# EAGLE design io (EAGLE 7.7.0)
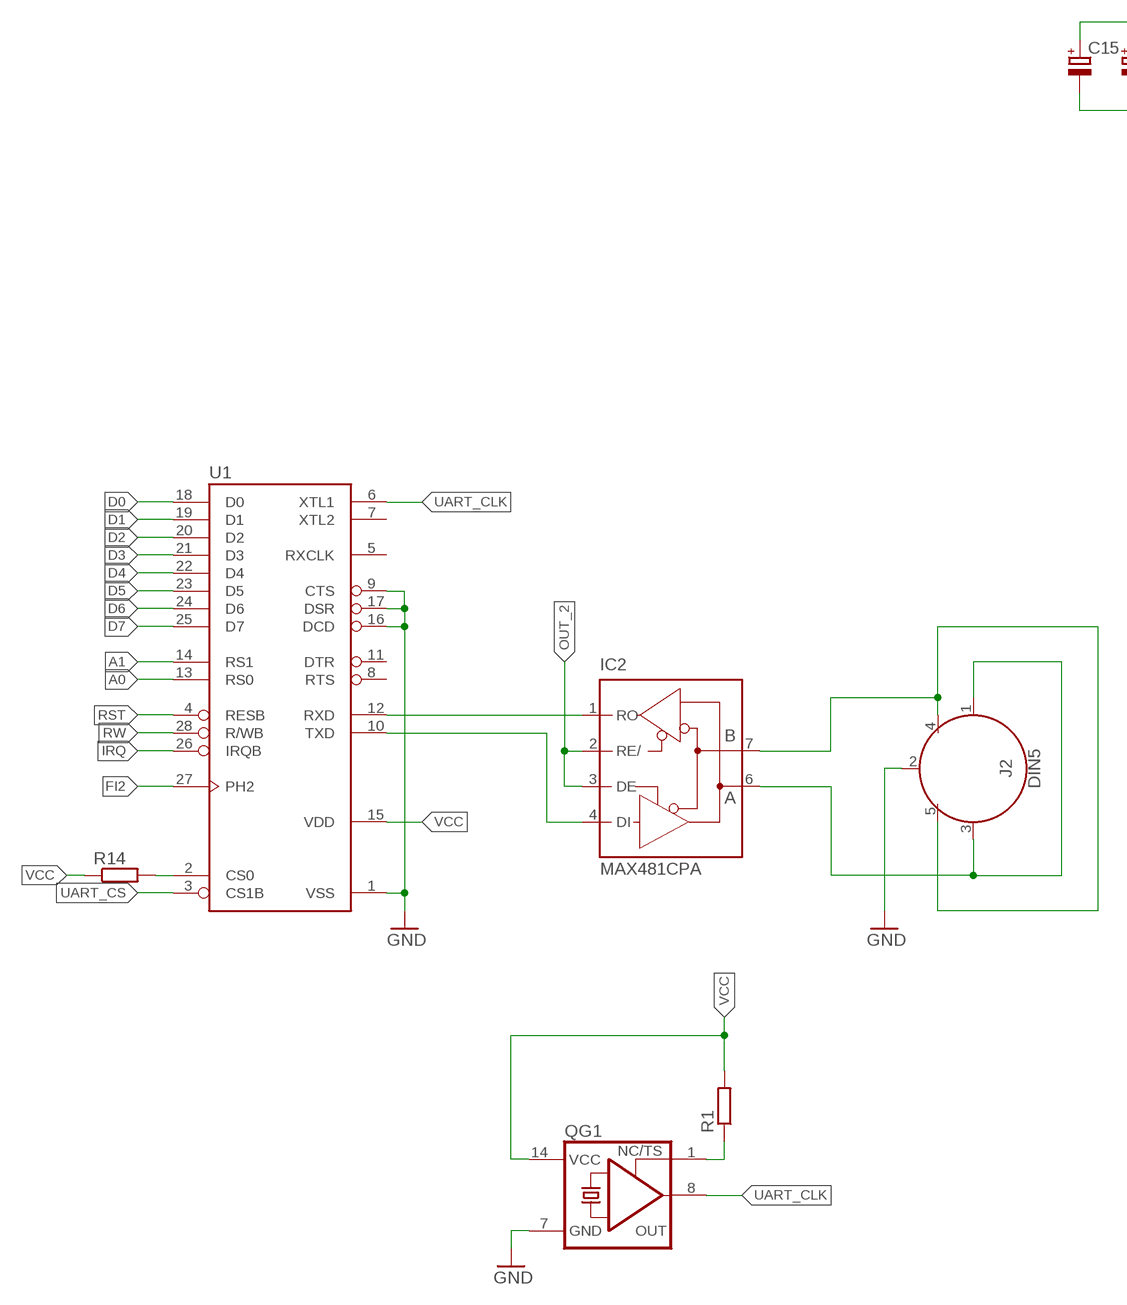
[diagram p0: schematic, sheet 1, part 1 of 2]
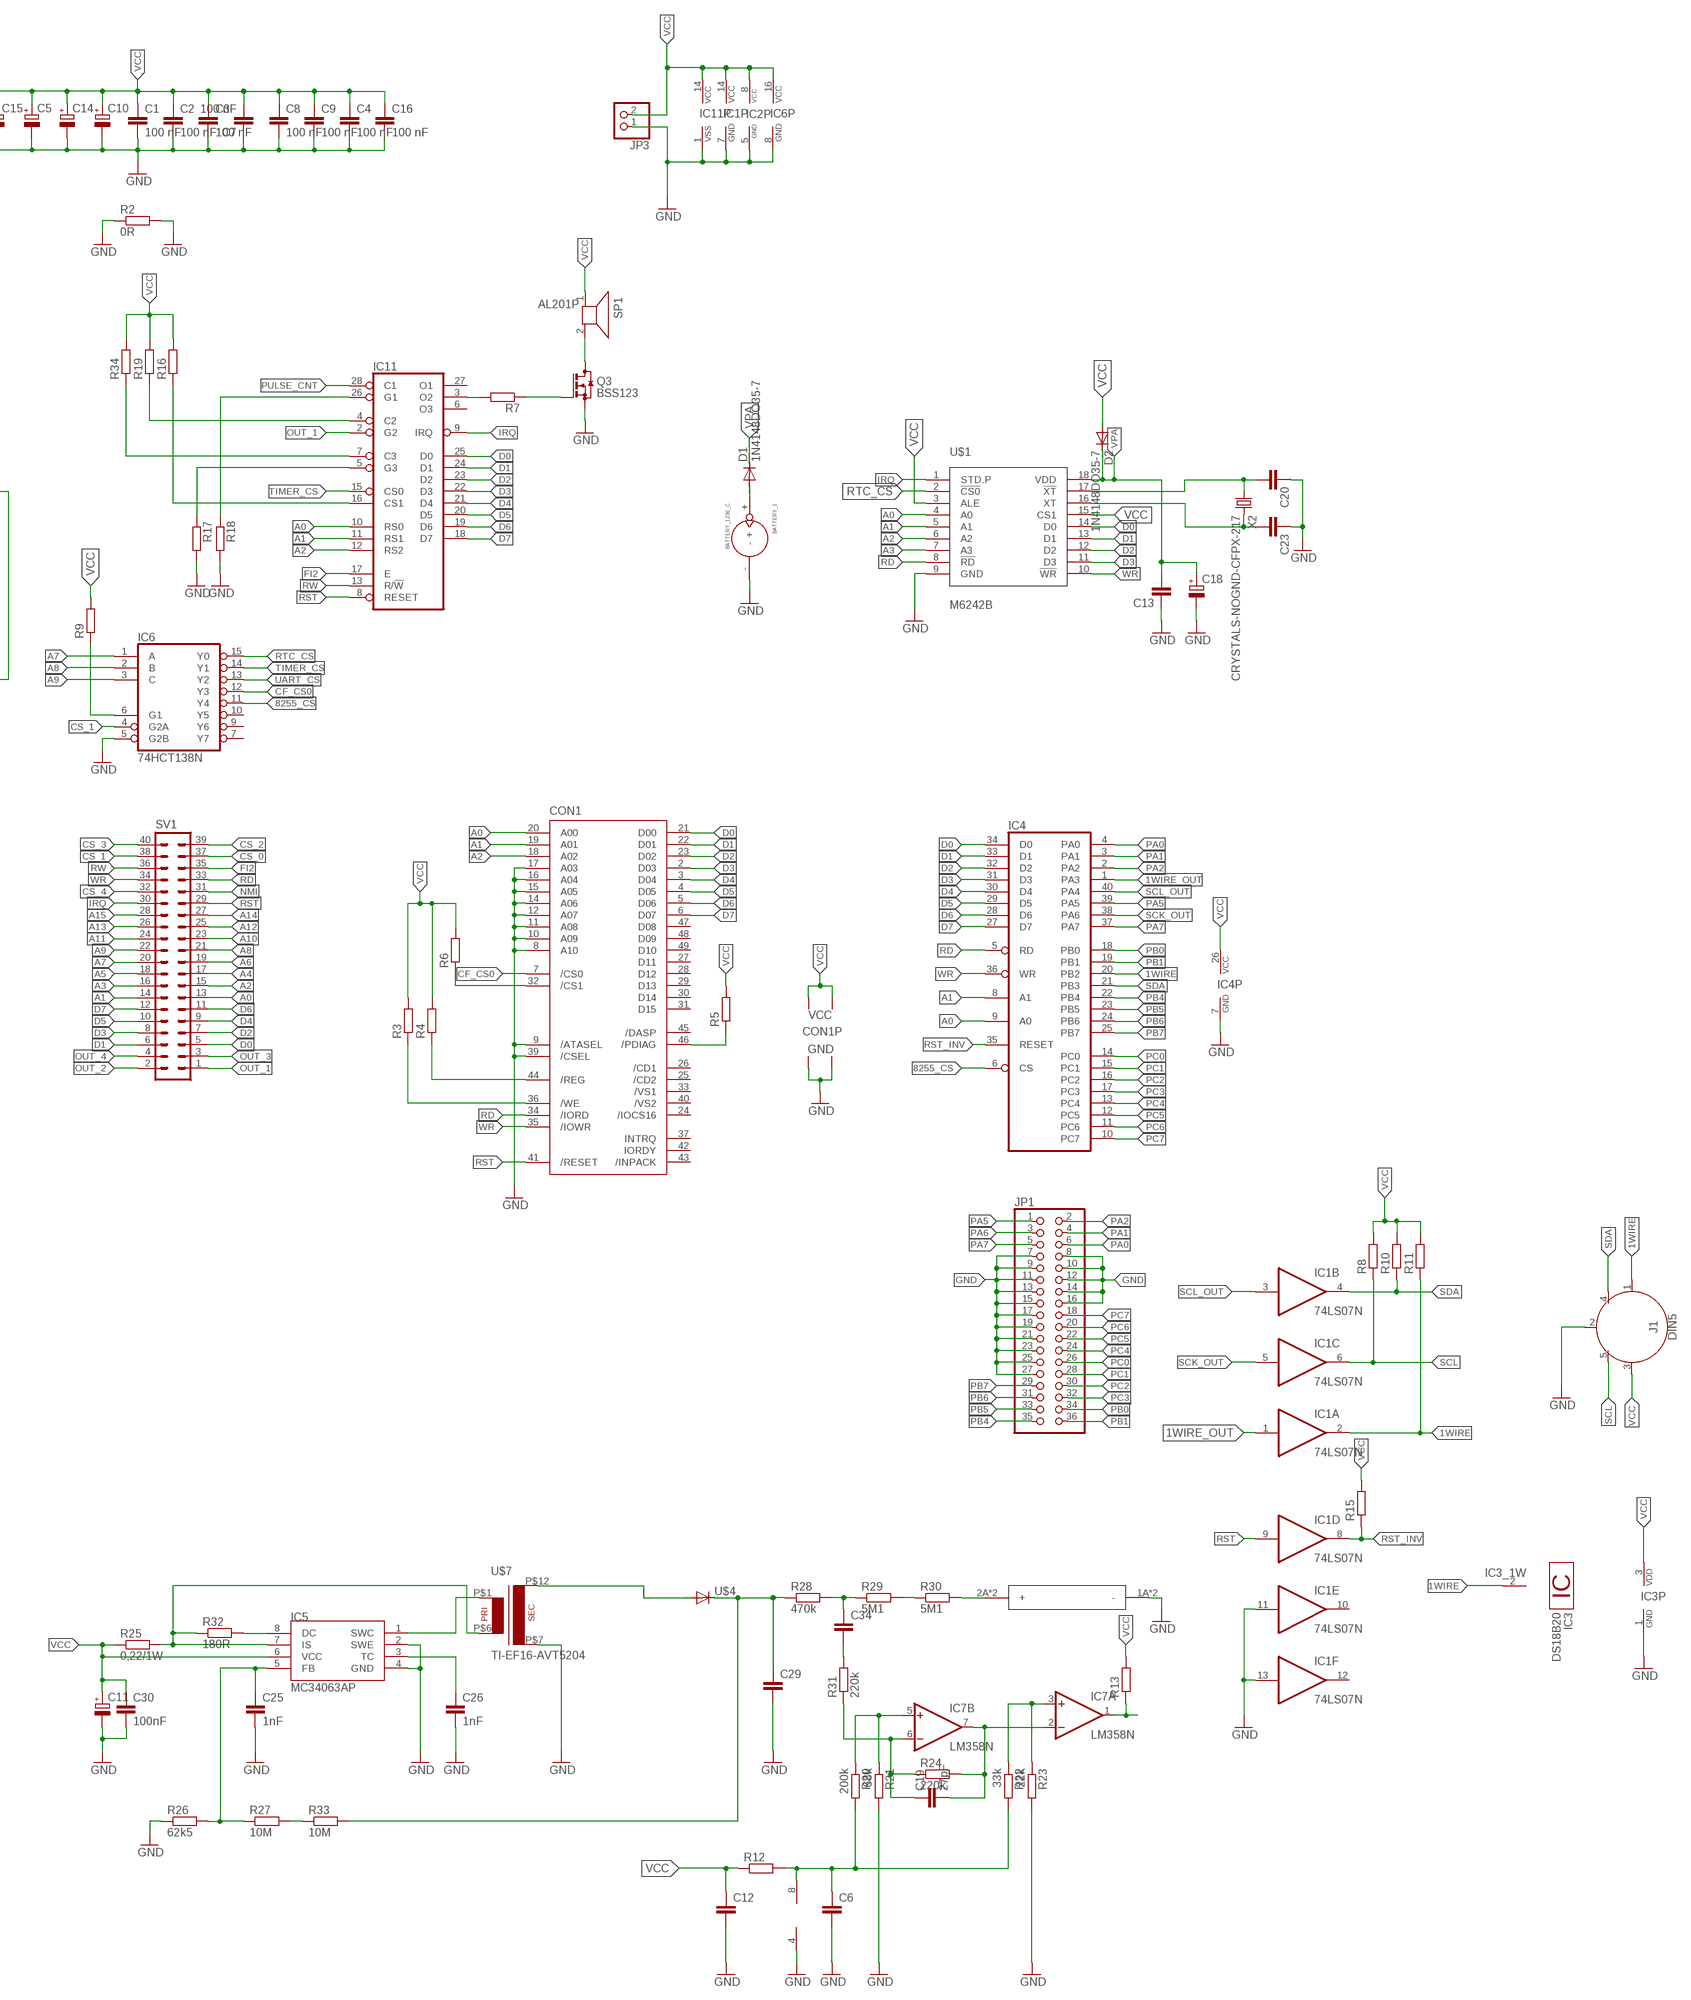
[diagram p1: schematic, sheet 1, part 2 of 2]

## Parts
BATTERY_1  BATTERY_1236_C  [BATTERY_1236_C]
C1  100 nF  C-EUC1206  [C1206]
C2  100 nF  C-EUC1206  [C1206]
C3  100 nF  C-EUC1206  [C1206]
C4  100 nF  C-EUC0603  [C0603]
C5  CPOL-EUSMCC  [SMC_C]
C6  C-EUC0603  [C0603]
C7  100 nF  C-EUC0603  [C0603]
C8  100 nF  C-EUC1206  [C1206]
C9  100 nF  C-EUC1206  [C1206]
C10  CPOL-EUE5-10.5  [E5-10,5]
C11  CPOL-EUSMCE  [SMC_E]
C12  C-EUC0603  [C0603]
C13  C-EUC0603  [C0603]
C14  CPOL-EUE3.5-8  [E3,5-8]
C15  CPOL-EUE5-10.5  [E5-10,5]
C16  100 nF  C-EUC0603  [C0603]
C18  CPOL-EUSMCB  [SMC_B]
C19  27pF  C-EUC0603  [C0603]
C20  C-EUC0603  [C0603]
C23  C-EUC0603  [C0603]
C25  1nF  C-EUC0603  [C0603]
C26  1nF  C-EUC0603  [C0603]
C29  C-EU225-113X268  [C225-113X268]
C30  100nF  C-EUC0603  [C0603]
C34  C-EU050-024X044  [C050-024X044]
CON1  CF-CARD-IDE_MODE  [MI20-50PD-SF]
D1  1N4148DO35-7  [DO35-7]
D2  1N4148DO35-7  [DO35-7]
IC1  74LS07N  [DIL14]
IC2  MAX481CPA  [DIL08]
IC3  DS18B20  [TO92-]
IC4  8255A  [DIL40]
IC5  MC34063AP  [DIL08]
IC6  74HCT138N  [DIL16]
IC7  LM358N  [DIL08]
IC11  6840  [DIL28]
J1  DIN5  [DIN5-RA-PTH]
J2  DIN5  [DIN5-RA-PTH]
JP1  PINHD-2X18  [2X18]
JP3  PINHD-1X2/90  [1X02/90]
Q3  BSS123  [SOT23]
QG1  XO-14  [DIL14S]
R1  R-EU_R1206  [R1206]
R2  0R  R-EU_M1206  [M1206]
R3  R-EU_R0603  [R0603]
R4  R-EU_R0603  [R0603]
R5  R-EU_R0603  [R0603]
R6  R-EU_R0603  [R0603]
R7  R-EU_0204/5  [0204/5]
R8  R-EU_0204/7  [0204/7]
R9  R-EU_R1206  [R1206]
R10  R-EU_0204/7  [0204/7]
R11  R-EU_0204/7  [0204/7]
R12  R-EU_0204/7  [0204/7]
R13  R-EU_R0603  [R0603]
R14  R-EU_R0603  [R0603]
R15  R-EU_R0603  [R0603]
R16  R-EU_R0402  [R0402]
R17  R-EU_0204/7  [0204/7]
R18  R-EU_R0603  [R0603]
R19  R-EU_0204/5  [0204/5]
R20  200k  R-EU_R0603  [R0603]
R21  68k  R-EU_R0603  [R0603]
R22  33k  R-EU_R0603  [R0603]
R23  22k  R-EU_R0603  [R0603]
R24  220k  R-EU_R0603  [R0603]
R25  0,22/1W  R-EU_R2010  [R2010]
R26  62k5  R-EU_R1206  [R1206]
R27  10M  R-EU_0204/7  [0204/7]
R28  470k  R-EU_R2512  [R2512]
R29  5M1  R-EU_R2512  [R2512]
R30  5M1  R-EU_R2512  [R2512]
R31  220k  R-EU_0204/7  [0204/7]
R32  180R  R-EU_R0805  [R0805]
R33  10M  R-EU_0204/7  [0204/7]
R34  R-EU_R0603  [R0603]
SP1  AL201P  [AL201P]
SV1  ML40L  [ML40L]
U1  G65SC51P  [DIP-28]
U$1  M6242B  [DIL18]
U$4  DIODE-MELF-MLL41  [MELF-MLL41]
U$5  STS5  [GEIGERTUBE]
U$7  TI-EF16-AVT5204  [EF16-K-H-12P-12,5]
X2  CRYSTALS-NOGND-CFPX-217  [3.2X1.5-2-PAD]

## Nets
1WIRE: IC1.2(A:O) IC3.2 IC4.20(PB2) J1.1 R11.1
1WIRE_OUT: IC1.1(A:I) IC4.1(PA3)
8255_CS: IC4.6(CS) IC6.11(Y4)
A0: CON1.20(A00) IC4.9(A0) IC11.10(RS0) SV1.13 U1.13(RS0) U$1.4(A0)
A1: CON1.19(A01) IC4.8(A1) IC11.11(RS1) SV1.14 U1.14(RS1) U$1.5(A1)
A2: CON1.18(A02) IC11.12(RS2) SV1.15 U$1.6(A2)
A3: SV1.16 U$1.7(A3)
A4: SV1.17
A5: SV1.18
A6: SV1.19
A7: IC6.1(A) SV1.20
A8: IC6.2(B) SV1.21
A9: IC6.3(C) SV1.22
A10: SV1.23
A11: SV1.24
A12: SV1.25
A13: SV1.26
A14: SV1.27
A15: SV1.28
A_3V: C6.1 IC7.8(P:V+) R12.2 R20.2 R22.2
CF_CS0: CON1.7(/CS0) IC6.12(Y3)
CS_0: SV1.37
CS_1: IC6.4(G2A) SV1.38
CS_2: SV1.39
CS_3: SV1.40
CS_4: SV1.32
D0: CON1.21(D00) IC4.34(D0) IC11.25(D0) SV1.5 U1.18(D0) U$1.14(D0)
D1: CON1.22(D01) IC4.33(D1) IC11.24(D1) SV1.6 U1.19(D1) U$1.13(D1)
D2: CON1.23(D02) IC4.32(D2) IC11.23(D2) SV1.7 U1.20(D2) U$1.12(D2)
D3: CON1.2(D03) IC4.31(D3) IC11.22(D3) SV1.8 U1.21(D3) U$1.11(D3)
D4: CON1.3(D04) IC4.30(D4) IC11.21(D4) SV1.9 U1.22(D4)
D5: CON1.4(D05) IC4.29(D5) IC11.20(D5) SV1.10 U1.23(D5)
D6: CON1.5(D06) IC4.28(D6) IC11.19(D6) SV1.11 U1.24(D6)
D7: CON1.6(D07) IC4.27(D7) IC11.18(D7) SV1.12 U1.25(D7)
FI2: IC11.17(E) SV1.35 U1.27(PH2)
GND: BATTERY_1.- C1.2 C2.2 C3.2 C4.2 C5.- C6.2 C7.1 C8.2 C9.2 C10.- C11.- C12.2 C13.1 C14.- C15.- C16.2 C18.- C20.1 C23.1 C25.2 C26.2 C29.2 C30.2 CON1.1(GND1) CON1.8(A10) CON1.9(/ATASEL) CON1.10(A09) CON1.11(A08) CON1.12(A07) CON1.14(A06) CON1.15(A05) CON1.16(A04) CON1.17(A03) CON1.39(/CSEL) CON1.50(GND2) IC1.7(P:GND) IC1.11(E:I) IC1.13(F:I) IC2.5(GND) IC3.1 IC4.7(GND) IC5.2(SWE) IC5.4(GND) IC6.5(G2B) IC6.8(GND) IC7.4(P:V-) IC11.1(VSS) J1.2 J2.2 JP1.7 JP1.8 JP1.9 JP1.10 JP1.11 JP1.12 JP1.13 JP1.14 JP1.15 JP1.16 JP1.17 JP1.19 JP1.21 JP1.23 JP1.25 JP1.27 JP3.1 Q3.2(S) QG1.7(GND) R2.1 R2.2 R17.2 R18.2 R21.2 R23.2 R26.1 U1.1(VSS) U1.9(CTS) U1.16(DCD) U1.17(DSR) U$1.9(GND) U$5.1A(-) U$5.1B(-) U$7.P$7(P7)
HV: C29.1 R28.1 R33.2 U$4.C
IRQ: IC11.9(IRQ) SV1.30 U1.26(IRQB) U$1.1(STD.P)
N$5: QG1.1(TS) R1.1
N$7: C19.1 IC7.6(B:-IN) R24.1 R31.1
N$9: IC5.7(IS) R25.2 R32.1 U$7.P$6(P6)
N$10: U$4.A U$7.P$12(P12)
N$11: C26.1 IC5.3(TC)
N$12: C25.1 IC5.5(FB) R26.2 R27.1
N$13: R30.2 U$5.2A(+) U$5.2B(+)
N$14: IC11.3(O2) R7.2
N$15: CON1.32(/CS1) R6.1
N$16: Q3.3(D) SP1.2
N$17: C19.2 IC7.2(A:-IN) IC7.7(B:OUT) R24.2
N$18: IC6.6(G1) R9.1
N$19: CON1.44(/REG) R4.1
N$20: CON1.36(/WE) R3.1
N$21: CON1.46(/PDIAG) R5.1
N$22: BATTERY_1.+ D1.A
N$26: R29.2 R30.1
N$27: C34.1 R28.2 R29.1
N$28: C34.2 R31.2
N$29: IC7.5(B:+IN) R20.1 R21.1
N$30: IC7.3(A:+IN) R22.1 R23.1
N$31: R14.2 U1.2(CS0)
N$32: IC11.16(CS1) R16.1
N$33: IC5.1(SWC) U$7.P$1(P1)
N$34: IC5.8(DC) R32.2
N$35: R27.2 R33.1
N$36: IC11.5(G3) R17.1
N$38: IC11.26(G1) R18.1
N$39: IC11.4(C2) R19.1
N$40: IC11.7(C3) R34.1
NMI: SV1.31
OUT_1: IC11.2(G2) SV1.1
OUT_2: IC2.2(RE/) IC2.3(DE) SV1.2
OUT_3: SV1.3
OUT_4: SV1.4
PA0: IC4.4(PA0) JP1.6
PA1: IC4.3(PA1) JP1.4
PA2: IC4.2(PA2) JP1.2
PA5: IC4.39(PA5) JP1.1
PA6: JP1.3
PA7: IC4.37(PA7) JP1.5
PB0: IC4.18(PB0) JP1.34
PB1: IC4.19(PB1) JP1.36
PB4: IC4.22(PB4) JP1.35
PB5: IC4.23(PB5) JP1.33
PB6: IC4.24(PB6) JP1.31
PB7: IC4.25(PB7) JP1.29
PC0: IC4.14(PC0) JP1.26
PC1: IC4.15(PC1) JP1.28
PC2: IC4.16(PC2) JP1.30
PC3: IC4.17(PC3) JP1.32
PC4: IC4.13(PC4) JP1.24
PC5: IC4.12(PC5) JP1.22
PC6: IC4.11(PC6) JP1.20
PC7: IC4.10(PC7) JP1.18
PULSE_CNT: IC7.1(A:OUT) IC11.28(C1) R13.1
RD: CON1.34(/IORD) IC4.5(RD) SV1.33 U$1.8(!RD)
RST: CON1.41(/RESET) IC1.9(D:I) IC11.8(RESET) SV1.29 U1.4(RESB)
RST_INV: IC1.8(D:O) IC4.35(RESET) R15.1
RTC_CS: IC6.15(Y0) U$1.2(!CS0)
RW: IC11.13(R/!W) SV1.36 U1.28(R/WB)
RX_A: IC2.6(A) J2.1 J2.3
RX_B: IC2.7(B) J2.4 J2.5
RXD: IC2.1(RO) U1.12(RXD)
SCK_OUT: IC1.5(C:I) IC4.38(PA6)
SCL: IC1.6(C:O) J1.5 R8.1
SCL_OUT: IC1.3(B:I) IC4.40(PA4)
SDA: IC1.4(B:O) IC4.21(PB3) J1.4 R10.1
SOSCI: C20.2 U$1.17(!XT) X2.1
SOSCO: C23.2 U$1.16(XT) X2.2
TICK: Q3.1(G) R7.1
TIMER_CS: IC6.14(Y1) IC11.15(CS0)
TXD: IC2.4(DI) U1.10(TXD)
UART_CLK: QG1.8(OUT) U1.6(XTL1)
UART_CS: IC6.13(Y2) U1.3(CS1B)
VCC: C1.1 C2.1 C3.1 C4.1 C5.+ C7.2 C8.1 C9.1 C10.+ C11.+ C12.1 C14.+ C15.+ C16.1 C30.1 CON1.13(VCC2) CON1.38(VCC1) D2.A IC1.14(P:VCC) IC2.8(VCC) IC3.3 IC4.26(VCC) IC5.6(VCC) IC6.16(VCC) IC11.14(VCC) J1.3 JP3.2 QG1.14(VCC) R1.2 R3.2 R4.2 R5.2 R6.2 R8.2 R9.2 R10.2 R11.2 R12.1 R13.2 R14.1 R15.2 R16.2 R19.2 R25.1 R34.2 SP1.1 U1.15(VDD) U$1.3(ALE) U$1.15(CS1)
VPA: C13.2 C18.+ D1.C D2.C U$1.18(VDD)
WR: CON1.35(/IOWR) IC4.36(WR) SV1.34 U$1.10(!WR)
Unconnected: CON1.24(/IOCS16) CON1.25(/CD2) CON1.26(/CD1) CON1.27(D11) CON1.28(D12) CON1.29(D13) CON1.30(D14) CON1.31(D15) CON1.33(/VS1) CON1.37(INTRQ) CON1.40(/VS2) CON1.42(IORDY) CON1.43(/INPACK) CON1.45(/DASP) CON1.47(D08) CON1.48(D09) CON1.49(D10) IC1.10(E:O) IC1.12(F:O) IC6.7(Y7) IC6.9(Y6) IC6.10(Y5) IC11.6(O3) IC11.27(O1) U1.5(RXCLK) U1.7(XTL2) U1.8(RTS) U1.11(DTR)

## Library data of the parts
BATTERY_1 = Itead_BP_110825.lbr:BATTERY_1236_C: SOC004
C1-C4 C6-C9 C12 C13 C16 C19 C20 C23 C25 C26 C29 C30 C34 = rcl:C-EU: CAPACITOR, European symbol
C5 C10 C11 C14 C15 C18 = rcl:CPOL-EU: POLARIZED CAPACITOR, European symbol
CON1 = con-hirose:CF-CARD-IDE_MODE: Compact Flash Adapter Type I or II without Eject Button Source: con-hirose.lbr from Bob Starr <rtzaudio@mindspring.com>; OC_FARNELL: unknown; OC_NEWARK: unknown
D1 D2 = diode:1N4148: DIODE high speed (Philips)
IC1 = 74xx-eu:74*07: Hex BUFFER, open collector high-voltage output
IC2 = maxim:MAX481CPA: RS485 TRANSEIVER; MPN: MAX481CPA+; OC_FARNELL: unknown; OC_NEWARK: 99K3445
IC3 = 1wire:DS18B20: Programmable Resolution Digital Thermometer This chip provides a onewire thermosensor with approx. 0.5°C accuracy. A programmable over/undertemperure alarm is available. The precision can be set from 9..12 bits. Notes: Vdd must be applied for accurate measurements at low temperatures, as the parasite power circuit otherwise heats the sensor. If parasite power is used, Vdd has to be connected to GND. The DS1822 is a low-cost thermometer chip, the DS18S20 is similar to the DS18B20, but with 9 Bit precision only. Author: Jan Kandziora <jjj@gmx.de>
IC4 = micro-intel:8255A: MICROCOMPUTER/PERIPHERAL DEVICE; OC_FARNELL: unknown; OC_NEWARK: unknown
IC5 = mc34063:MC34063
IC6 = 74xx-eu:74*138: 3-line to 8-line DECODER/DEMULTIPLEXER
IC7 = linear:LM358: OP AMP also LM158; LM258; LM2904 Source: http://cache.national.com/ds/LM/LM158.pdf
IC11 = micro-motorola:6840: MICROCONTROLLER/MEMORY DEVICE; OC_FARNELL: unknown; OC_NEWARK: unknown
J1 J2 = SparkFun-Connectors:DIN5: DIN5 Connector - Female Right Angle (frequently used as a MIDI Jack connector) This type of connector and cable is frequently used for transmitting midi data (musical instrument digital interface). It is what you usually see on a keyboard or set of electronic drums. Learn more here <https://en.wikipedia.org/wiki/MIDI>. For more information on the pinout and electrical specifications of MIDI communications, please see the following resource: https://www.midi.org/specifications/item/midi-din-electrical-specification Here is the connector we sell at SparkFun: MIDI Connector - Female Right Angle <https://www.sparkfun.com/products/9536> (PRT-09536) Datasheet <hhttp://www.sparkfun.com/datasheets/Prototyping/Connectors/MIDI-RA.pdf> It is used on this SparkFun product: SparkFun MIDI Shield <https://www.sparkfun.com/products/12898> (DEV-12898); PROD_ID: CONN-09481
JP1 = pinhead:PINHD-2X18: PIN HEADER
JP3 = pinhead:PINHD-1X2: PIN HEADER
Q3 = transistor-small-signal:BSS123: N-CHANNEL MOS FET
QG1 = crystal:XO-: CRYSTAL; OC_FARNELL: unknown; OC_NEWARK: unknown
R1-R34 = rcl:R-EU_: RESISTOR, European symbol
SP1 = buzzer:AL201P: SPEAKER Source: Buerklin; OC_FARNELL: unknown; OC_NEWARK: unknown
SV1 = con-harting-ml:ML40: HARTING; OC_FARNELL: unknown; OC_NEWARK: unknown
U1 = 65xxx:G65SC51P: California Micro Devices Version
U$1 = mw:M6242B
U$4 = diode:DIODE-: DIODE
U$5 = mw:STS5
U$7 = trafo:TI-EF16-AVT5204
X2 = IQD-Frequency-Products:CRYSTALS-NOGND: CRYSTALS CAN NOT GROUNDED

## Board
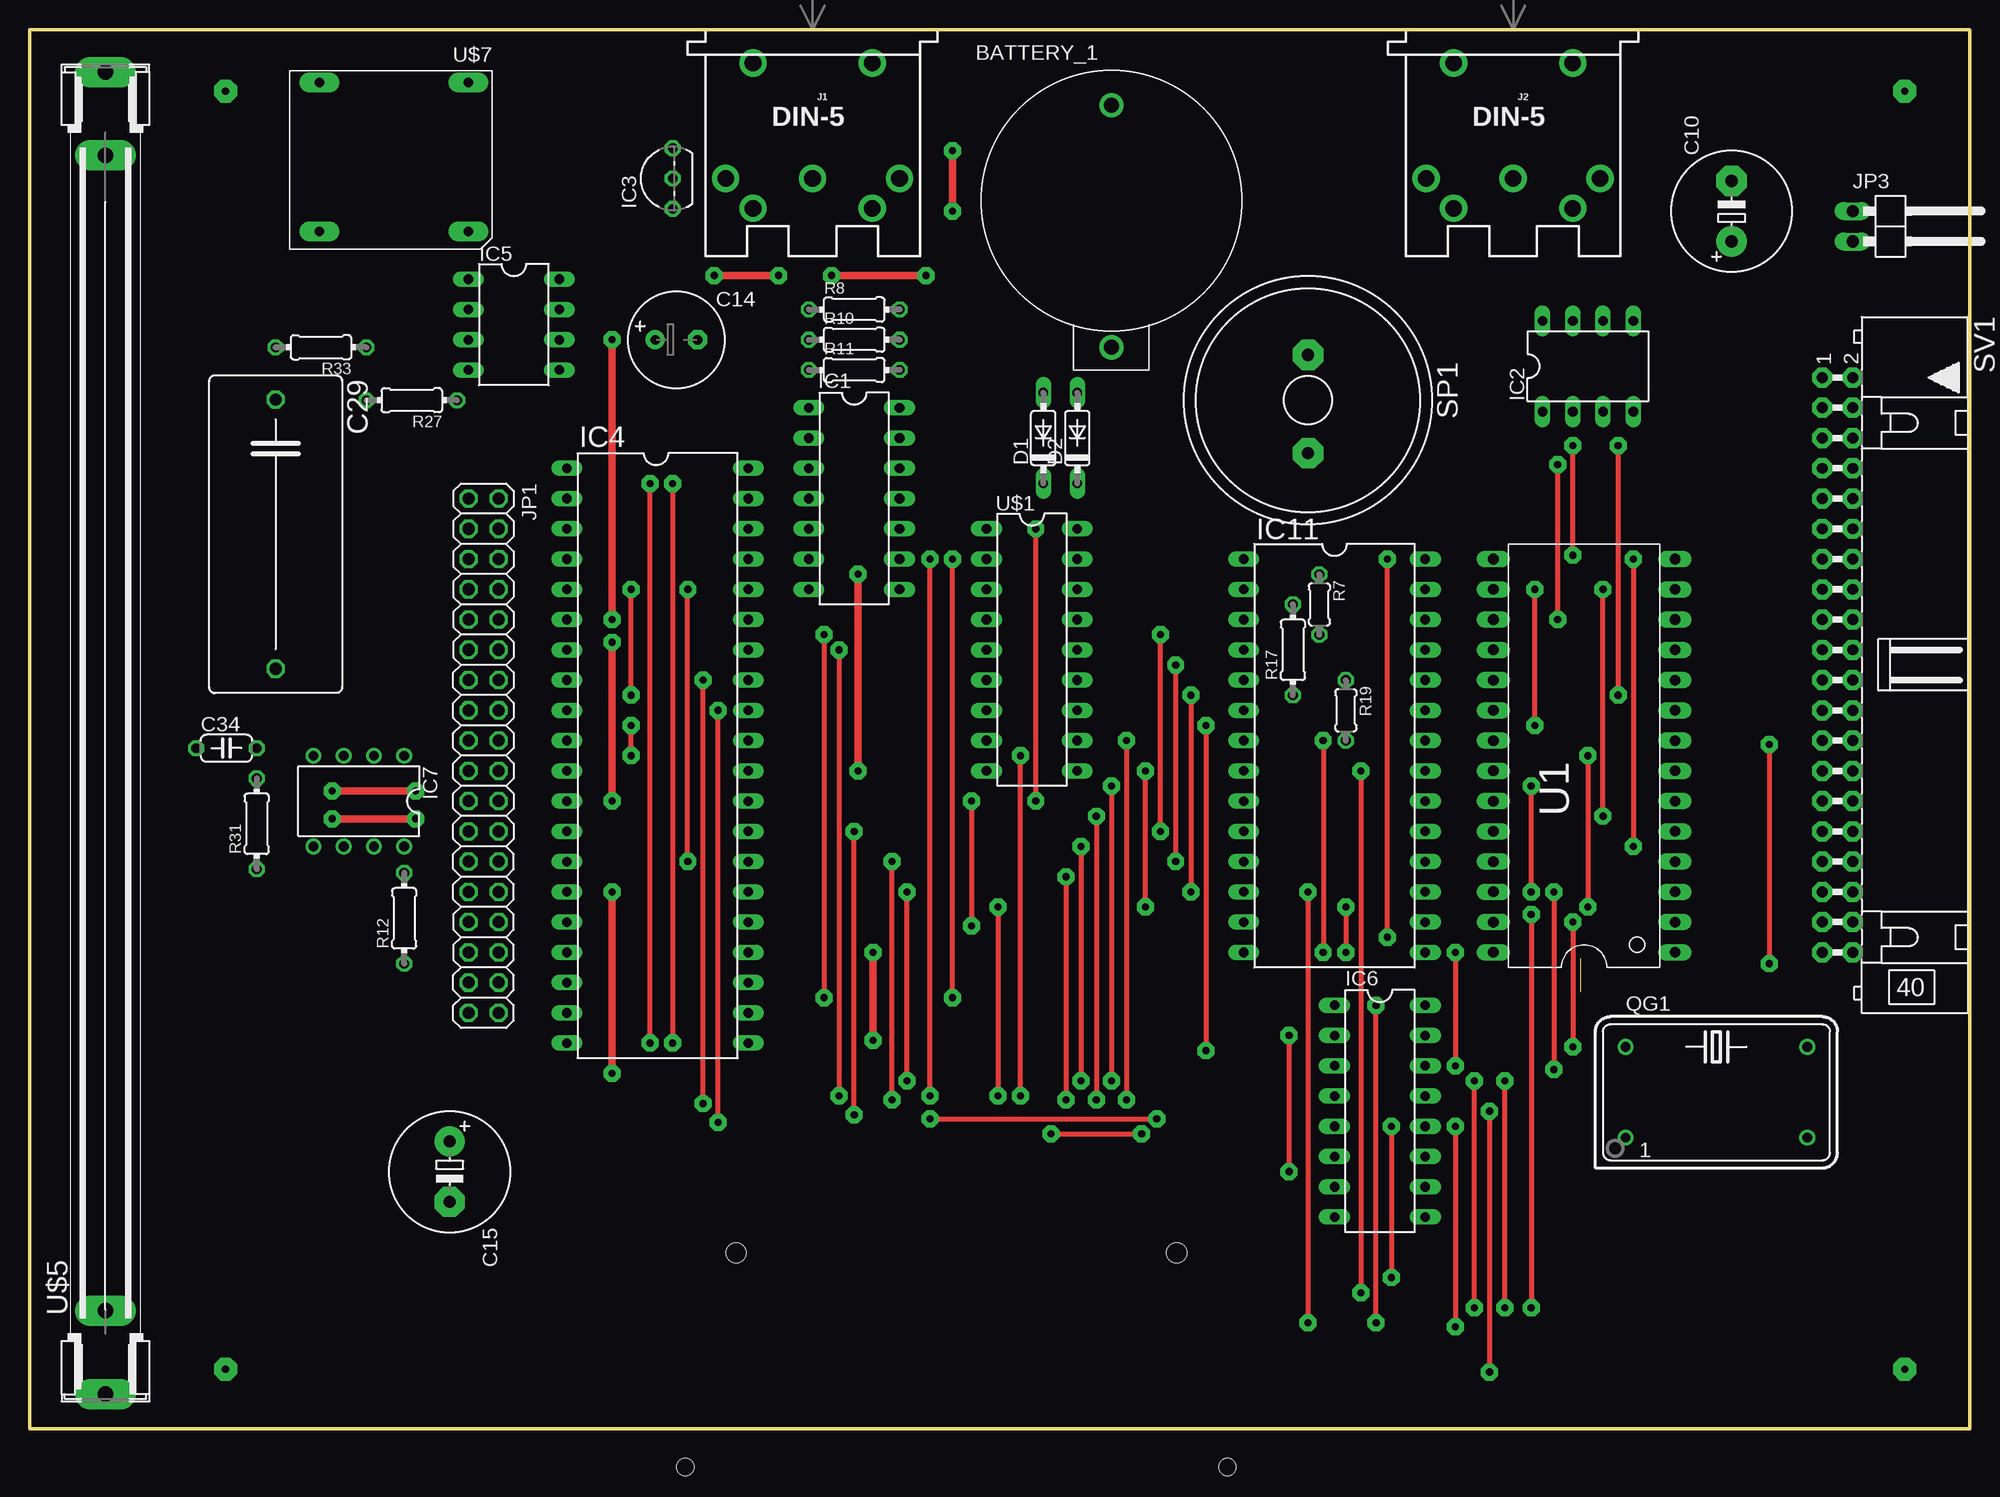
[diagram p2: board, top side]
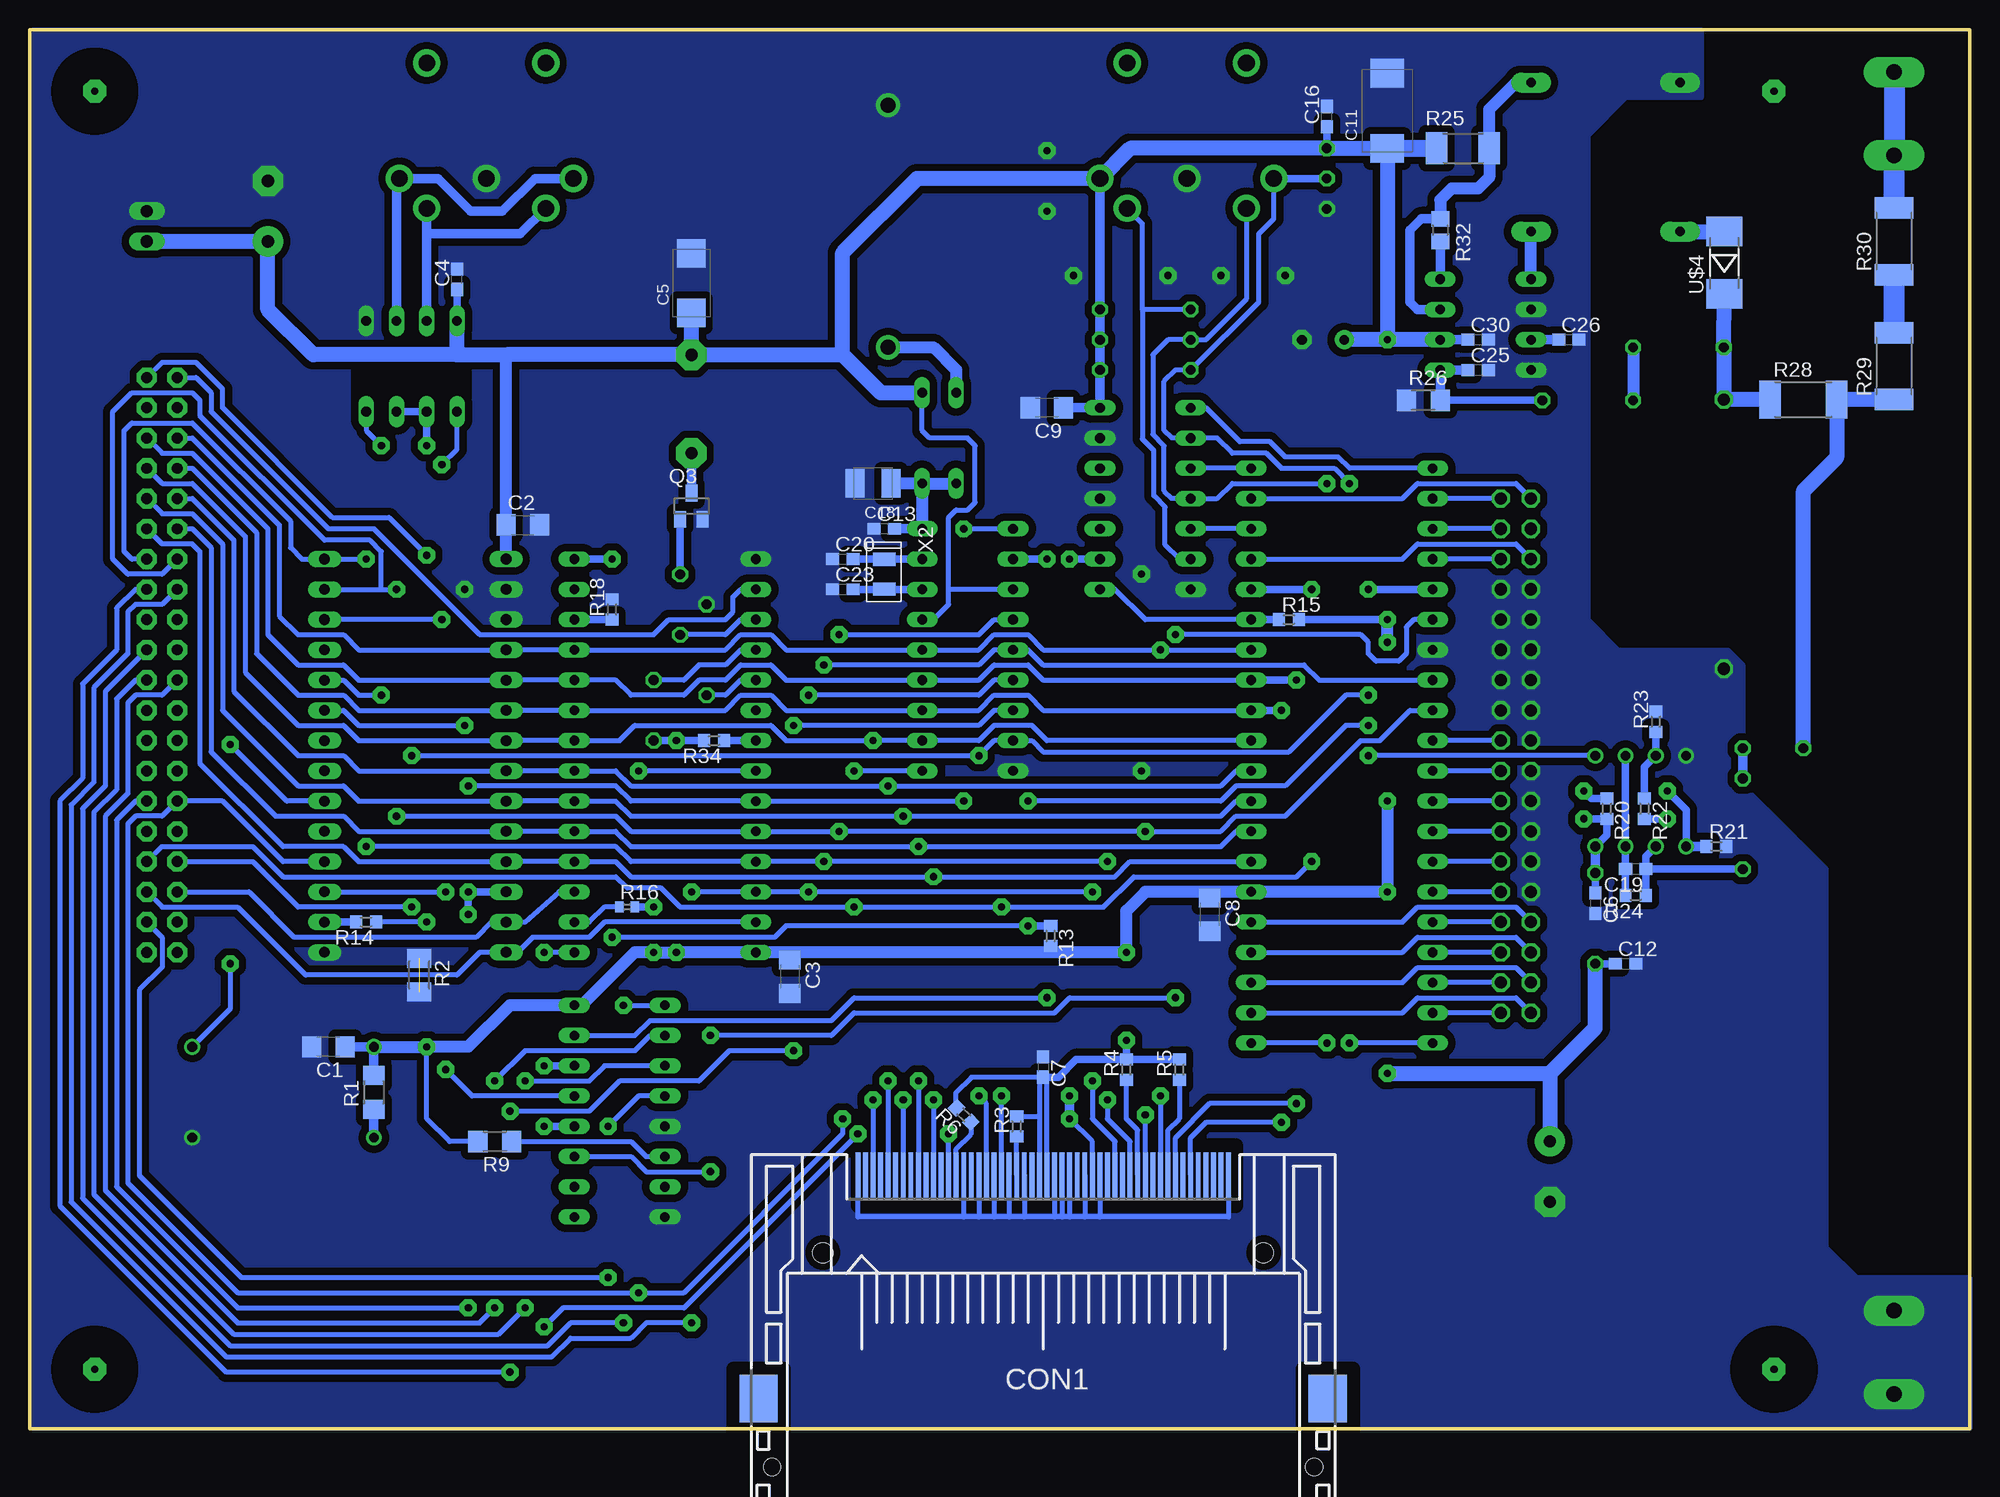
[diagram p3: board, bottom side, seen from below]

Size 162.87 x 117.47 mm. Coordinates in mm from the lower left corner, seen from the top.
Outline: 0,0 162.87,0 162.87,117.47 0,117.47 0,0
Copper layers (1*16): Top 0.035mm / dielectric 1.5mm / Bottom 0.035mm
Design rules "default *": minimum track width 10mil, minimum drill 24mil, track to track 8mil, track to pad 8mil, pad to pad 8mil, via to via 8mil, smd to smd 8mil, copper to edge 0mil, drill to drill 8mil, minimum pad ring 10mil, minimum via ring 8mil, stop-mask expansion 4mil, vias tented up to drill 0mil, thermal gap 10mil
bRestrict: area 13.4,2 to 19.5,8; area 13.4,109.3 to 19.5,115.4; area 154.4,2 to 160.4,8; area 154.4,109.3 to 160.4,115.4; area 61.6,18.7 to 93.3,23.8; area 126.3,86.4 to 135.3,88.9; area 123.8,57.8 to 140.3,61.6

### Footprints (pad centres in the part's own frame; a part is rotated, then mirrored left to right if it is on the bottom)
BATTERY_1236_C = drill 1.27 pad 2.032: + 0,0; - 0,20.32
C1206 = smd 1.6 x 1.8: 1 -1.4,0; 2 1.4,0
C0603 = smd 1.1 x 1: 1 -0.85,0; 2 0.85,0
SMC_C = smd 2.4 x 2.4: + -2.5,0; - 2.5,0
E5-10,5 = drill 1.016 pad 2.54: + -2.54,0 | drill 1.016 pad 2.54 octagon: - 2.54,0
SMC_E = smd 2.4 x 2.8: + -3.15,0; - 3.15,0
E3,5-8 = drill 0.813 pad 1.6: + -1.778,0 | drill 0.813 pad 1.6 octagon: - 1.778,0
SMC_B = smd 1.6 x 2.4: + -1.5,0; - 1.5,0
C225-113X268 = drill 1.016 octagon: 1 -11.303,0; 2 11.303,0
C050-024X044 = drill 0.813 octagon: 1 -2.54,0; 2 2.54,0
MI20-50PD-SF = smd 0.41 x 3.75: 1 15.557,-18.78; 2 14.287,-18.78; 3 13.018,-18.78; 4 11.748,-18.78; 5 10.477,-18.78; 6 9.207,-18.78; 7 7.938,-18.78; 8 6.668,-18.78; 9 5.397,-18.78; 10 4.128,-18.78; 11 2.857,-18.78; 12 1.587,-18.78; 13 0.318,-18.78; 14 -0.953,-18.78; 15 -2.223,-18.78; 16 -3.493,-18.78; 17 -4.763,-18.78; 18 -6.032,-18.78; 19 -7.303,-18.78; 20 -8.572,-18.78; 21 -9.842,-18.78; 22 -11.113,-18.78; 23 -12.383,-18.78; 24 -13.652,-18.78; 25 -14.922,-18.78; 26 14.922,-18.78; 27 13.652,-18.78; 28 12.383,-18.78; 29 11.113,-18.78; 30 9.842,-18.78; 31 8.572,-18.78; 32 7.303,-18.78; 33 6.032,-18.78; 34 4.763,-18.78; 35 3.493,-18.78; 36 2.223,-18.78; 37 0.953,-18.78; 38 -0.318,-18.78; 39 -1.587,-18.78; 40 -2.857,-18.78; 41 -4.128,-18.78; 42 -5.397,-18.78; 43 -6.668,-18.78; 44 -7.938,-18.78; 45 -9.207,-18.78; 46 -10.477,-18.78; 47 -11.748,-18.78; 48 -13.018,-18.78; 49 -14.287,-18.78; 50 -15.557,-18.78 | smd 3.2 x 4: M1 -23.883,-0.005; M2 23.883,-0.005 | hole 1.676: 18.5,-12.25; -18.5,-12.25 | hole 1.422: -22.75,5.75; 22.75,5.75
DO35-7 = drill 0.813 long: A 3.81,0; C -3.81,0
DIL14 = drill 0.813 long: 1 -7.62,-3.81; 2 -5.08,-3.81; 3 -2.54,-3.81; 4 0,-3.81; 5 2.54,-3.81; 6 5.08,-3.81; 7 7.62,-3.81; 8 7.62,3.81; 9 5.08,3.81; 10 2.54,3.81; 11 0,3.81; 12 -2.54,3.81; 13 -5.08,3.81; 14 -7.62,3.81
DIL08 = drill 0.813 long: 1 -3.81,-3.81; 2 -1.27,-3.81; 3 1.27,-3.81; 4 3.81,-3.81; 5 3.81,3.81; 6 1.27,3.81; 7 -1.27,3.81; 8 -3.81,3.81
TO92- = drill 0.813 octagon: 1 -2.54,0; 2 0,0; 3 2.54,0
DIL40 = drill 0.813 long: 1 -24.13,-7.62; 2 -21.59,-7.62; 3 -19.05,-7.62; 4 -16.51,-7.62; 5 -13.97,-7.62; 6 -11.43,-7.62; 7 -8.89,-7.62; 8 -6.35,-7.62; 9 -3.81,-7.62; 10 -1.27,-7.62; 11 1.27,-7.62; 12 3.81,-7.62; 13 6.35,-7.62; 14 8.89,-7.62; 15 11.43,-7.62; 16 13.97,-7.62; 17 16.51,-7.62; 18 19.05,-7.62; 19 21.59,-7.62; 20 24.13,-7.62; 21 24.13,7.62; 22 21.59,7.62; 23 19.05,7.62; 24 16.51,7.62; 25 13.97,7.62; 26 11.43,7.62; 27 8.89,7.62; 28 6.35,7.62; 29 3.81,7.62; 30 1.27,7.62; 31 -1.27,7.62; 32 -3.81,7.62; 33 -6.35,7.62; 34 -8.89,7.62; 35 -11.43,7.62; 36 -13.97,7.62; 37 -16.51,7.62; 38 -19.05,7.62; 39 -21.59,7.62; 40 -24.13,7.62
DIL16 = drill 0.813 long: 1 -8.89,-3.81; 2 -6.35,-3.81; 3 -3.81,-3.81; 4 -1.27,-3.81; 5 1.27,-3.81; 6 3.81,-3.81; 7 6.35,-3.81; 8 8.89,-3.81; 9 8.89,3.81; 10 6.35,3.81; 11 3.81,3.81; 12 1.27,3.81; 13 -1.27,3.81; 14 -3.81,3.81; 15 -6.35,3.81; 16 -8.89,3.81
DIL08' = drill 0.813 pad 1.27: 1 -3.81,-3.81; 2 -1.27,-3.81; 3 1.27,-3.81; 4 3.81,-3.81; 5 3.81,3.81; 6 1.27,3.81; 7 -1.27,3.81; 8 -3.81,3.81
DIL28 = drill 0.813 long: 1 -16.51,-7.62; 2 -13.97,-7.62; 3 -11.43,-7.62; 4 -8.89,-7.62; 5 -6.35,-7.62; 6 -3.81,-7.62; 7 -1.27,-7.62; 8 1.27,-7.62; 9 3.81,-7.62; 10 6.35,-7.62; 11 8.89,-7.62; 12 11.43,-7.62; 13 13.97,-7.62; 14 16.51,-7.62; 15 16.51,7.62; 16 13.97,7.62; 17 11.43,7.62; 18 8.89,7.62; 19 6.35,7.62; 20 3.81,7.62; 21 1.27,7.62; 22 -1.27,7.62; 23 -3.81,7.62; 24 -6.35,7.62; 25 -8.89,7.62; 26 -11.43,7.62; 27 -13.97,7.62; 28 -16.51,7.62
DIN5-RA-PTH = drill 1.4 pad 2.286: 1 7.3,12.5; 2 0,12.5; 3 -7.3,12.5; 4 5,15; 5 -5,15; 6 -5,2.8; 7 5,2.8
2X18 = drill 1.016 octagon: 1 -21.59,-1.27; 2 -21.59,1.27; 3 -19.05,-1.27; 4 -19.05,1.27; 5 -16.51,-1.27; 6 -16.51,1.27; 7 -13.97,-1.27; 8 -13.97,1.27; 9 -11.43,-1.27; 10 -11.43,1.27; 11 -8.89,-1.27; 12 -8.89,1.27; 13 -6.35,-1.27; 14 -6.35,1.27; 15 -3.81,-1.27; 16 -3.81,1.27; 17 -1.27,-1.27; 18 -1.27,1.27; 19 1.27,-1.27; 20 1.27,1.27; 21 3.81,-1.27; 22 3.81,1.27; 23 6.35,-1.27; 24 6.35,1.27; 25 8.89,-1.27; 26 8.89,1.27; 27 11.43,-1.27; 28 11.43,1.27; 29 13.97,-1.27; 30 13.97,1.27; 31 16.51,-1.27; 32 16.51,1.27; 33 19.05,-1.27; 34 19.05,1.27; 35 21.59,-1.27; 36 21.59,1.27
1X02/90 = drill 1.016 long: 1 -1.27,-3.81; 2 1.27,-3.81
SOT23 = smd 1 x 1.4: 1 -0.95,-1.1; 2 0.95,-1.1; 3 0,1.1
DIL14S = drill 0.813: 1 -7.62,-3.81; 7 7.62,-3.81; 8 7.62,3.81; 14 -7.62,3.81
R1206 = smd 1.6 x 1.803: 1 -1.422,0; 2 1.422,0
M1206 = smd 1.6 x 2: 1 -1.4,0; 2 1.4,0
R0603 = smd 1 x 1.1: 1 -0.85,0; 2 0.85,0
0204/5 = drill 0.813 octagon: 1 -2.54,0; 2 2.54,0
0204/7 = drill 0.813 octagon: 1 -3.81,0; 2 3.81,0
R0402 = smd 0.7 x 0.9: 1 -0.65,0; 2 0.65,0
R2010 = smd 1.8 x 2.7: 1 -2.2,0; 2 2.2,0
R2512 = smd 1.8 x 3.2: 1 -2.8,0; 2 2.8,0
R0805 = smd 1.3 x 1.5: 1 -0.95,0; 2 0.95,0
AL201P = drill 1.016 pad 2.54 octagon: 1 -3.81,0; 2 4.445,0
ML40L = drill 0.914 pad 1.676 octagon: 1 -24.13,-1.27; 2 -24.13,1.27; 3 -21.59,-1.27; 4 -21.59,1.27; 5 -19.05,-1.27; 6 -19.05,1.27; 7 -16.51,-1.27; 8 -16.51,1.27; 9 -13.97,-1.27; 10 -13.97,1.27; 11 -11.43,-1.27; 12 -11.43,1.27; 13 -8.89,-1.27; 14 -8.89,1.27; 15 -6.35,-1.27; 16 -6.35,1.27; 17 -3.81,-1.27; 18 -3.81,1.27; 19 -1.27,-1.27; 20 -1.27,1.27; 21 1.27,-1.27; 22 1.27,1.27; 23 3.81,-1.27; 24 3.81,1.27; 25 6.35,-1.27; 26 6.35,1.27; 27 8.89,-1.27; 28 8.89,1.27; 29 11.43,-1.27; 30 11.43,1.27; 31 13.97,-1.27; 32 13.97,1.27; 33 16.51,-1.27; 34 16.51,1.27; 35 19.05,-1.27; 36 19.05,1.27; 37 21.59,-1.27; 38 21.59,1.27; 39 24.13,-1.27; 40 24.13,1.27
DIP-28 = drill 0.889 long: 1 -15.24,-7.62; 2 -12.7,-7.62; 3 -10.16,-7.62; 4 -7.62,-7.62; 5 -5.08,-7.62; 6 -2.54,-7.62; 7 0,-7.62; 8 2.54,-7.62; 9 5.08,-7.62; 10 7.62,-7.62; 11 10.16,-7.62; 12 12.7,-7.62; 13 15.24,-7.62; 14 17.78,-7.62; 15 17.78,7.62; 16 15.24,7.62; 17 12.7,7.62; 18 10.16,7.62; 19 7.62,7.62; 20 5.08,7.62; 21 2.54,7.62; 22 0,7.62; 23 -2.54,7.62; 24 -5.08,7.62; 25 -7.62,7.62; 26 -10.16,7.62; 27 -12.7,7.62; 28 -15.24,7.62
DIL18 = drill 0.813 long: 1 -10.16,-3.81; 2 -7.62,-3.81; 3 -5.08,-3.81; 4 -2.54,-3.81; 5 0,-3.81; 6 2.54,-3.81; 7 5.08,-3.81; 8 7.62,-3.81; 9 10.16,-3.81; 10 10.16,3.81; 11 7.62,3.81; 12 5.08,3.81; 13 2.54,3.81; 14 0,3.81; 15 -2.54,3.81; 16 -5.08,3.81; 17 -7.62,3.81; 18 -10.16,3.81
MELF-MLL41 = smd 2.5 x 3: A 2.625,0; C -2.625,0
GEIGERTUBE = drill 1.321 pad 2.54 long: 1A -10.414,0; 1B -3.414,0; 2A 93.586,0; 2B 100.586,0
EF16-K-H-12P-12,5 = drill 0.8 pad 1.676 long: P$1 0,12.5; P$6 0,0; P$7 12.5,0; P$12 12.5,12.5
3.2X1.5-2-PAD = smd 1.1 x 1.9: 1 -1.25,0; 2 1.25,0

### Placement (x,y rotation side)
BATTERY_1  90.81,90.81 0 top
C1  137.79,32.07 180 bottom
C2  121.48,75.88 0 bottom
C3  99.06,37.97 270 bottom
C4  127,96.52 90 bottom
C5  107.31,96.2 90 bottom
C6  31.43,44.13 270 bottom
C7  77.79,30.38 270 bottom
C8  63.82,43.18 270 bottom
C9  77.47,85.72 180 bottom
C10  142.88,102.23 90 top
C11  48.9,110.67 90 bottom
C12  28.89,39.05 0 bottom
C13  91.12,75.56 0 bottom
C14  54.29,91.44 0 top
C15  35.24,21.59 270 top
C16  53.98,110.17 90 bottom
C18  92.07,79.38 180 bottom
C19  28.04,46.99 180 bottom
C20  94.62,73.03 0 bottom
C23  94.62,70.48 0 bottom
C25  41.27,88.9 0 bottom
C26  33.66,91.44 0 bottom
C29  20.64,75.11 270 top
C30  41.27,91.44 0 bottom
C34  16.51,57.15 0 top
CON1  77.79,2.54 180 bottom
D1  85.09,83.19 90 top
D2  87.95,83.19 90 top
IC1  69.22,78.11 270 top
IC2  130.81,89.22 0 top
IC3  53.98,104.97 90 top
IC4  52.7,56.52 270 top
IC5  40.64,92.71 270 top
IC6  113.35,26.67 270 top
IC7  LM358N  [DIL08']  27.62,52.7 180 top
IC11  109.54,56.52 270 top
J1  65.72,117.47 180 top
J2  124.54,117.47 180 top
JP1  38.1,56.52 270 top
JP3  156.84,100.97 270 top
Q3  107.31,77.47 0 bottom
QG1  141.61,28.26 0 top
R1  133.99,28.26 90 bottom
R2  130.18,38.1 270 bottom
R3  80.01,25.4 90 bottom
R4  70.8,30.16 90 bottom
R5  66.36,30.16 90 bottom
R6  84.46,26.35 135 bottom
R7  108.26,69.22 270 top
R8  69.22,93.98 0 top
R9  123.82,24.13 180 bottom
R10  69.22,91.44 0 top
R11  69.22,88.9 0 top
R12  31.43,42.86 90 top
R13  77.15,41.38 270 bottom
R14  134.62,42.55 180 bottom
R15  57.15,67.94 0 bottom
R16  112.71,43.81 0 bottom
R17  106.04,65.41 90 top
R18  113.98,68.8 90 bottom
R19  110.49,60.33 270 top
R20  30.48,52.07 270 bottom
R21  21.27,48.9 0 bottom
R22  27.3,52.07 270 bottom
R23  26.35,59.37 90 bottom
R24  28.04,44.77 180 bottom
R25  42.55,107.52 0 bottom
R26  45.87,86.36 0 bottom
R27  32.07,86.36 180 top
R28  13.97,86.42 0 bottom
R29  6.35,89.22 90 bottom
R30  6.35,99.69 90 bottom
R31  19.05,50.8 90 top
R32  44.45,100.63 270 bottom
R33  24.45,90.81 180 top
R34  105.41,57.78 180 bottom
SP1  107.31,86.36 270 top
SV1  151.77,64.14 270 top
U1  130.49,55.24 90 top
U$1  84.14,65.41 270 top
U$4  20.61,97.92 90 bottom
U$5  6.35,13.34 90 top
U$7  36.83,113.03 180 top
X2  91.12,71.75 270 bottom

### Tracks (layer width: path | path; a pad name or v marks a point on that pad's centre or on a via)
1WIRE  (via drill 0.6 pad 1.42)
  Top 0.406: v52.07,32.38 v52.07,79.38
  Bottom 0.406: IC4.20 v52.07,32.38 | v52.07,79.38 53.34,80.64 57.78,80.64 59.05,81.92 61.91,81.92 63.18,83.19 IC1.2 66.99,83.19 67.63,83.82 67.63,87.95 66.67,88.9 R11.1 59.69,94.61 59.69,100.33 58.42,101.6 J1.1
  Bottom 0.61: IC3.2 J1.1
1WIRE_OUT
  Bottom 0.406: IC4.1 52.07,80.64 53.02,81.6 57.47,81.6 58.74,82.87 61.28,82.87 64.13,85.72 IC1.1
8255_CS  (via drill 0.6 pad 1.42)
  Top 0.406: v66.67,66.67 v66.67,36.2 | v105.73,33.02 v105.73,21.59
  Bottom 0.406: IC4.6 46.67,67.94 47.31,67.31 47.31,65.09 47.94,64.45 49.85,64.45 50.48,65.09 50.48,66.04 51.12,66.67 v66.67,66.67 | IC6.11 112.4,22.86 111.12,21.59 v105.73,21.59 | v66.67,36.2 75.56,36.2 76.84,34.92 93.66,34.92 95.57,33.02 v105.73,33.02
A0  (via drill 0.6 pad 1.42)
  Top 0.406: v94.93,50.16 v94.93,66.67 | v132.08,51.44 v132.08,70.48 | v69.22,26.35 v69.22,50.16
  Bottom 0.406: U1.13 133.35,70.48 | SV1.13 151.77,71.75 154.62,71.75 155.89,73.03 155.89,85.41 154.31,87 149.22,87 148.59,86.36 148.59,85.09 138.11,74.61 134.3,74.61 133.35,73.66 133.35,70.48 | v94.93,66.67 83.19,66.67 81.91,67.94 U$1.4 | v132.08,51.44 113.66,51.44 112.4,50.16 IC11.10 v94.93,50.16 v69.22,50.16 62.87,50.16 61.59,51.44 57.47,51.44 51.12,57.78 49.53,57.78 46.99,60.33 IC4.9 | CON1.20 v69.22,26.35 | 133.35,70.48 v132.08,70.48
A1  (via drill 0.6 pad 1.42)
  Top 0.406: v134.62,73.03 v134.62,48.9 | v96.2,64.14 v96.2,47.62 | v72.39,27.62 v72.39,47.62
  Bottom 0.406: SV1.14 154.31,73.03 154.94,73.66 154.94,83.82 154.31,84.45 149.22,84.45 140.97,76.2 140.97,73.98 140.02,73.03 U1.14 v134.62,73.03 | v96.2,64.14 83.19,64.14 81.91,65.41 U$1.5 79.06,65.41 77.79,64.14 55.88,64.14 54.61,62.87 IC4.8 | v134.62,48.9 113.66,48.9 112.4,47.62 IC11.11 v96.2,47.62 v72.39,47.62 | CON1.19 70.48,24.13 72.39,26.04 v72.39,27.62
A2  (via drill 0.6 pad 1.42)
  Top 0.406: v97.47,61.59 v97.47,45.09 | v107.31,45.09 v107.31,8.89 | v73.66,29.21 v73.66,45.09
  Bottom 0.406: v107.31,45.09 IC11.12 v97.47,45.09 v73.66,45.09 | U$1.6 81.91,62.87 83.19,61.59 v97.47,61.59 | SV1.15 151.77,69.22 153.99,69.22 154.62,68.58 154.62,65.09 157.48,62.23 157.48,54.29 159.39,52.39 159.39,19.05 146.37,6.03 119.06,6.03 117.47,7.62 112.4,7.62 111.12,8.89 v107.31,8.89 | CON1.18 71.75,24.13 73.66,26.04 v73.66,29.21
A3  (via drill 0.6 pad 1.42)
  Top 0.406: v98.74,59.05 v98.74,31.75 | v122.56,26.67 v122.56,4.76
  Bottom 0.406: U$1.7 81.91,60.33 83.19,59.05 v98.74,59.05 | SV1.16 153.99,70.48 155.58,68.9 155.58,65.41 158.43,62.55 158.43,54.61 160.34,52.7 160.34,18.73 146.37,4.76 v122.56,4.76 | v122.56,26.67 115.89,26.67 113.35,29.21 106.68,29.21 104.14,31.75 v98.74,31.75
A7  (via drill 0.6 pad 1.42)
  Top 0.406: v113.03,8.89 v113.03,35.56
  Bottom 0.406: SV1.20 156.53,61.91 156.53,53.98 158.43,52.07 158.43,19.37 146.05,6.99 119.38,6.99 117.47,8.89 v113.03,8.89 | v113.03,35.56 IC6.1
A8  (via drill 0.6 pad 1.42)
  Top 0.406: v123.82,10.16 v123.82,29.21
  Bottom 0.406: SV1.21 151.77,61.59 153.99,61.59 154.62,60.96 154.62,53.34 156.53,51.44 156.53,20 145.42,8.89 125.09,8.89 v123.82,10.16 | IC6.2 110.81,33.02 112.08,31.75 121.28,31.75 v123.82,29.21
A9  (via drill 0.6 pad 1.42)
  Top 0.406: v121.28,10.16 v121.28,29.21
  Bottom 0.406: SV1.22 153.99,62.87 155.58,61.28 155.58,53.66 157.48,51.75 157.48,19.68 145.73,7.94 123.51,7.94 v121.28,10.16 | v121.28,29.21 115.89,29.21 114.62,30.48 IC6.3
A_3V  (via drill 0.6 pad 1.42)
  Top 0.61: v32.38,51.22 v25.4,51.22
  Bottom 0.61: IC7.8 30.48,49.85 R20.2 v32.38,51.22 | v25.4,51.22 R22.2 | R12.2 C6.1
  Bottom 0.813: R12.2 IC7.8
CF_CS0  (via drill 0.6 pad 1.42)
  Top 0.406: v85.72,24.77 v93.34,24.77 | v119.7,25.4 v119.7,8.57
  Bottom 0.406: CON1.7 v85.72,24.77 | v93.34,24.77 107.95,10.16 118.11,10.16 v119.7,8.57
  Bottom 0.61: IC6.12 v119.7,25.4
CS_1  (via drill 0.6 pad 1.42)
  Top 0.406: v114.3,25.4 v114.3,12.7
  Bottom 0.406: SV1.38 151.77,41.27 151.77,38.73 153.67,36.83 153.67,21.27 145.1,12.7 v114.3,12.7 | IC6.4 111.76,27.94 v114.3,25.4
D0  (via drill 0.6 pad 1.42)
  Top 0.406: v67.94,65.41 v67.94,27.94
  Bottom 0.406: SV1.5 149.22,83.19 141.92,75.88 141.92,68.26 140.34,66.67 136.53,66.67 135.25,65.41 U1.18 IC11.25 104.46,65.41 103.19,66.67 100.65,66.67 99.38,65.41 U$1.14 83.19,65.41 81.91,66.67 79.06,66.67 77.79,65.41 v67.94,65.41 IC4.34 | v67.94,27.94 CON1.21
D1  (via drill 0.6 pad 1.42)
  Top 0.406: v56.52,27.3 v56.52,62.87
  Bottom 0.406: SV1.6 151.77,81.92 149.22,81.92 142.88,75.56 142.88,66.67 140.34,64.14 136.53,64.14 135.25,62.87 U1.19 IC11.24 113.66,62.87 112.4,61.59 107.95,61.59 106.68,62.87 104.46,62.87 103.19,64.14 100.65,64.14 99.38,62.87 U$1.13 83.19,62.87 81.91,64.14 79.06,64.14 77.79,62.87 IC4.33 | CON1.22 66.67,24.45 63.82,27.3 v56.52,27.3
  Bottom 0.61: IC4.33 v56.52,62.87
D2  (via drill 0.6 pad 1.42)
  Top 0.406: v57.78,25.72 v57.78,60.33
  Bottom 0.406: SV1.7 149.22,80.64 143.83,75.25 143.83,65.09 140.34,61.59 136.53,61.59 135.25,60.33 U1.20 IC11.23 104.46,60.33 103.19,61.59 100.65,61.59 99.38,60.33 U$1.12 83.19,60.33 81.91,61.59 79.06,61.59 77.79,60.33 IC4.32 | CON1.23 65.41,24.45 64.13,25.72 v57.78,25.72
  Bottom 0.61: IC4.32 v57.78,60.33
D3  (via drill 0.6 pad 1.42)
  Top 0.406: v92.07,57.78 v92.07,27.62
  Bottom 0.406: SV1.8 151.77,79.38 149.22,79.38 144.78,74.93 144.78,63.5 140.34,59.05 136.53,59.05 135.25,57.78 U1.21 IC11.22 113.35,57.78 112.08,59.05 100.65,59.05 99.38,57.78 v92.07,57.78 U$1.11 83.19,57.78 81.91,59.05 78.74,59.05 77.47,57.78 IC4.31 | v92.07,27.62 CON1.2
D4  (via drill 0.6 pad 1.42)
  Top 0.406: v90.81,53.98 v90.81,29.21
  Bottom 0.406: SV1.9 149.22,78.11 145.73,74.61 145.73,61.91 140.34,56.52 136.53,56.52 135.25,55.24 U1.22 IC11.21 113.66,55.24 112.4,53.98 v90.81,53.98 62.87,53.98 61.59,55.24 IC4.30 | v90.81,29.21 CON1.3
D5  (via drill 0.6 pad 1.42)
  Top 0.406: v89.53,51.44 v89.53,27.62
  Bottom 0.406: SV1.10 151.77,76.83 149.22,76.83 146.69,74.3 146.69,60.33 140.34,53.98 136.53,53.98 135.25,52.7 U1.23 IC11.20 113.66,52.7 112.4,51.44 v89.53,51.44 62.87,51.44 61.59,52.7 IC4.29 | v89.53,27.62 CON1.4
D6  (via drill 0.6 pad 1.42)
  Top 0.406: v88.26,48.9 v88.26,29.21
  Bottom 0.406: SV1.11 149.22,75.56 147.64,73.98 147.64,56.83 142.24,51.44 136.53,51.44 135.25,50.16 U1.24 IC11.19 113.66,50.16 112.4,48.9 v88.26,48.9 62.87,48.9 61.59,50.16 IC4.28 | v88.26,29.21 CON1.5
D7  (via drill 0.6 pad 1.42)
  Top 0.406: v87,46.35 v87,27.62
  Bottom 0.406: SV1.12 151.77,74.3 149.22,74.3 148.59,73.66 148.59,55.88 141.61,48.9 136.53,48.9 135.25,47.62 U1.25 IC11.18 113.66,47.62 112.4,46.35 v87,46.35 71.75,46.35 70.48,47.62 IC4.27 | v87,27.62 CON1.6
FI2
  Bottom 0.406: SV1.35 144.46,45.09 140.65,41.27 125.41,41.27 124.14,42.55 U1.27 121.28,42.55 118.43,45.09 IC11.17
GND  (via drill 0.6 pad 1.42)  (1 unrouted)
  Top 0.406: v126.37,59.05 v126.37,70.48
  Top 0.61: v69.53,71.75 v69.53,55.24 | v77.47,107.31 v77.47,102.23 | v57.47,96.84 v62.87,96.84 | v67.31,96.84 v75.25,96.84
  Bottom 0.406: CON1.50 62.23,17.78 73.03,17.78 | 73.03,17.78 74.3,17.78 | 74.3,17.78 75.56,17.78 | 75.56,17.78 76.2,17.78 | 76.2,17.78 76.84,17.78 | 76.84,17.78 79.38,17.78 | 79.38,17.78 80.65,17.78 | 80.65,17.78 81.91,17.78 | 81.91,17.78 83.19,17.78 | 83.19,17.78 84.46,17.78 | 84.46,17.78 93.34,17.78 CON1.1 | CON1.8 84.46,17.78 | CON1.9 83.19,17.78 | CON1.11 80.65,17.78 | CON1.10 81.91,17.78 | CON1.12 79.38,17.78 | CON1.14 76.84,17.78 | CON1.39 76.2,17.78 | CON1.15 75.56,17.78 | CON1.17 73.03,17.78 | CON1.16 74.3,17.78 | U1.9 136.53,60.33 135.25,59.05 v126.37,59.05
  pour Bottom (isolate 0.61, no thermals): 162.56,117.47 22.54,117.47 22.54,111.76 28.89,111.76 32.07,108.58 32.07,67.94 29.53,65.41 20.32,65.41 19.05,64.14 19.05,53.98 12.06,46.99 12.06,15.24 9.53,12.7 0,12.7 0,0 162.56,0
HV
  Bottom 1.27: U$4.C R33.2 C29.1 R28.1
IRQ  (via drill 0.6 pad 1.42)
  Top 0.406: v84.46,52.7 v84.46,75.56 | v126.05,45.09 v126.05,53.98 | v126.05,43.18 v126.05,10.16
  Bottom 0.406: v84.46,52.7 IC11.9 112.4,52.7 113.66,53.98 v126.05,53.98 | v84.46,75.56 U$1.1 | SV1.30 153.99,52.7 155.58,51.12 155.58,20.32 145.42,10.16 v126.05,10.16
  Bottom 0.61: U1.26 v126.05,45.09 v126.05,43.18
N$5
  Bottom 0.813: R1.1 QG1.1
N$7
  Bottom 0.61: C19.1 R31.1 | R24.1 C19.1 | C19.1 27.19,48.06 IC7.6
N$9
  Bottom 0.813: R32.1 46.05,101.58 46.99,100.65 46.99,94.61 46.35,93.98 IC5.7
  Bottom 1.016: U$7.P$6 38.1,113.03 40.34,110.78 R25.2 40.34,105.07 41.27,104.14 43.5,104.14 44.45,103.19 R32.1
N$10
  Bottom 1.27: U$7.P$12 20.62,100.53 U$4.A
N$11
  Bottom 0.813: C26.1 IC5.3
N$12
  Bottom 0.61: R27.1 R26.2 | IC5.5
  Bottom 0.813: R26.2 IC5.5 C25.1
N$13
  Bottom 1.778: R30.2 U$5.2A U$5.2B
N$14
  Bottom 0.406: IC11.3 103.19,67.94 104.46,66.67 R7.2
N$15
  Bottom 0.406: CON1.32 85.09,23.5 83.85,24.73 R6.1
N$16
  Bottom 0.813: Q3.3 SP1.2
N$17
  Bottom 0.61: IC7.2 IC7.7 28.89,46.36 C19.2 R24.2
N$18
  Bottom 0.406: R9.1 112.4,24.13 111.12,22.86 IC6.6
N$19
  Bottom 0.406: CON1.44 69.85,25.08 70.8,26.04 R4.1
N$20
  Bottom 0.406: CON1.36 R3.1
N$21
  Bottom 0.406: CON1.46 67.31,25.08 66.36,26.04 R5.1
N$22
  Bottom 1.016: D1.A 85.09,88.9 87,90.81 BATTERY_1.+
N$23  (via drill 0.6 pad 1.93)
  other vias: 16.43,112.31
N$24  (via drill 0.6 pad 1.93)
  other vias: 157.4,5
N$25  (via drill 0.6 pad 1.93)
  other vias: 157.4,112.31
N$26
  Bottom 1.778: R29.2 R30.1
N$27
  Bottom 1.27: R29.1 R28.2 11.17,81.54 13.97,78.74 C34.1
N$28
  Bottom 0.813: C34.2 R31.2
N$29  (via drill 0.6 pad 1.42)
  Top 0.61: v25.4,53.55 v32.38,53.55
  Bottom 0.61: IC7.5 23.81,51.97 v25.4,53.55 | R20.1 31.75,52.92 v32.38,53.55
  Bottom 0.813: R21.1 IC7.5
N$30
  Bottom 0.61: R23.1 IC7.3 27.3,55.56 R22.1
N$31
  Bottom 0.61: U1.2 R14.2
N$32
  Bottom 0.406: R16.1 114.62,43.81 115.89,42.55 IC11.16
N$33
  Bottom 1.016: IC5.1 U$7.P$1
N$34
  Bottom 0.813: R32.2 IC5.8
N$35
  Bottom 1.016: R33.1 R27.2
N$36
  Bottom 0.406: IC11.5 103.19,62.87 104.46,61.59 R17.1
N$37  (via drill 0.6 pad 1.93)
  other vias: 16.43,5
N$38
  Bottom 0.61: IC11.26 R18.1
N$39
  Bottom 0.406: IC11.4 103.19,65.41 104.46,64.14 106.68,64.14 107.95,62.87 R19.1
N$40
  Bottom 0.61: IC11.7 R34.1
OUT_1
  Bottom 0.406: SV1.1 148.91,88.27 147.64,87 147.64,85.41 137.79,75.56 133.99,75.56 125.09,66.67 110.49,66.67 109.22,67.94 104.46,67.94 103.82,68.58 103.82,69.85 103.19,70.48 IC11.2
OUT_2  (via drill 0.6 pad 1.42)
  Top 0.406: v129.54,73.34 v129.54,82.55
  Bottom 0.406: SV1.2 151.77,89.53 148.91,89.53 146.69,87.31 146.69,85.72 137.48,76.52 132.72,76.52 v129.54,73.34
  Bottom 0.61: IC2.3 IC2.2 v129.54,82.55
PA0
  Bottom 0.406: JP1.6 IC4.4
PA1
  Bottom 0.406: JP1.4 IC4.3
PA2
  Bottom 0.406: JP1.2 IC4.2
PA5
  Bottom 0.406: IC4.39 47.62,78.11 46.35,79.38 38.1,79.38 JP1.1
PA7
  Bottom 0.406: IC4.37 47.62,73.03 46.35,74.3 38.1,74.3 JP1.5
PB0
  Bottom 0.406: JP1.34 IC4.18
PB1
  Bottom 0.406: JP1.36 IC4.19
PB4
  Bottom 0.406: IC4.22 47.62,34.92 46.35,36.2 38.1,36.2 JP1.35
PB5
  Bottom 0.406: IC4.23 47.62,37.47 46.35,38.73 38.1,38.73 JP1.33
PB6
  Bottom 0.406: IC4.24 47.62,40.01 46.35,41.27 38.1,41.27 JP1.31
PB7
  Bottom 0.406: IC4.25 47.62,42.55 46.35,43.81 38.1,43.81 JP1.29
PC0
  Bottom 0.406: JP1.26 IC4.14
PC1
  Bottom 0.406: JP1.28 IC4.15
PC2
  Bottom 0.406: JP1.30 IC4.16
PC3
  Bottom 0.406: JP1.32 IC4.17
PC4
  Bottom 0.406: JP1.24 IC4.13
PC5
  Bottom 0.406: JP1.22 IC4.12
PC6
  Bottom 0.406: JP1.20 IC4.11
PC7
  Bottom 0.406: JP1.18 IC4.10
PULSE_CNT  (via drill 0.6 pad 1.42)
  Top 0.406: v79.06,52.7 v79.06,42.23 | v113.98,41.27 v113.98,73.03 | v50.48,56.52 v50.48,59.05
  Bottom 0.406: IC7.1 v50.48,56.52 | v50.48,59.05 52.39,59.05 57.47,53.98 61.59,53.98 62.87,52.7 v79.06,52.7 | v79.06,42.23 99.38,42.23 100.33,41.27 v113.98,41.27
  Bottom 0.61: R13.1 v79.06,42.23 | v79.06,42.23 | v113.98,73.03 IC11.28
RD  (via drill 0.6 pad 1.42)
  Top 0.406: v130.81,56.52 v130.81,43.81 | v83.19,27.94 v83.19,56.52 | v50.48,61.59 v50.48,70.48
  Bottom 0.406: SV1.33 144.15,47.62 140.34,43.81 v130.81,43.81 | v130.81,56.52 v83.19,56.52 | v83.19,56.52 82.87,56.52 | v83.19,56.52 81.91,57.78 U$1.8 78.74,57.78 77.79,56.83 57.15,56.83 52.39,61.59 v50.48,61.59 | CON1.34 82.55,27.3 v83.19,27.94
  Bottom 0.61: v50.48,70.48 IC4.5
RST  (via drill 0.6 pad 1.42)
  Top 0.406: v111.76,55.24 v111.76,11.43 | v75.56,26.04 v94.62,26.04 | v75.56,27.94 v75.56,73.03
  Bottom 0.406: IC11.8 v111.76,55.24 | CON1.41 73.66,24.13 v75.56,26.04 | v94.62,26.04 94.62,24.77 107.95,11.43 v111.76,11.43 145.42,11.43 154.62,20.64 154.62,50.8 153.99,51.44 151.77,51.44 SV1.29 146.69,52.7 141.61,47.62 U1.4
  Bottom 0.61: IC1.9 v75.56,73.03
  Bottom 0.813: v75.56,26.04 v75.56,27.94
RST_INV
  Bottom 0.406: IC4.35 69.22,67.94 71.75,70.48 IC1.8
  Bottom 0.61: R15.1 IC4.35
RTC_CS  (via drill 0.6 pad 1.42)
  Top 0.406: v77.47,36.2 v77.47,73.03
  Bottom 0.406: IC6.15 112.08,33.02 110.81,34.29 95.57,34.29 93.66,36.2 v77.47,36.2
  Bottom 0.61: v77.47,73.03 U$1.2
RW
  Bottom 0.406: SV1.36 151.77,43.81 145.42,43.81 139.7,38.1 127,38.1 125.09,40.01 U1.28 121.92,40.01 120.65,41.27 115.89,41.27 114.62,42.55 IC11.13
RX_A
  Bottom 0.61: 132.08,104.73 J2.3
  Bottom 0.813: IC2.6 132.08,104.73 | J2.1 120.45,104.97 123.19,102.23 125.86,102.23 128.6,104.97 J2.3
RX_B
  Bottom 0.61: J2.5
  Bottom 0.813: IC2.7 129.54,100.33 | 129.54,100.33 J2.5 | 129.54,100.33 121.68,100.33 J2.4
RXD  (via drill 0.6 pad 1.42)
  Top 0.406: v128.27,67.94 v128.27,80.96
  Bottom 0.406: v128.27,67.94 U1.12 | IC2.1 127,82.23 v128.27,80.96
SCK_OUT
  Bottom 0.406: IC4.38 IC1.5
SCL
  Bottom 0.406: IC1.6 66.36,73.03 67.55,74.22 67.55,77.39 68.5,78.34 68.5,82.15 69.45,83.11 69.45,93.98 | R8.1 69.45,93.98 | 69.45,93.98 69.45,101.2 J1.5
SCL_OUT
  Bottom 0.406: IC4.40 IC1.3
SDA  (via drill 0.6 pad 1.42)
  Top 0.406: v53.98,79.38 v53.98,32.38
  Bottom 0.406: v53.98,79.38 61.91,79.38 63.18,78.11 IC1.4 66.99,78.11 67.63,78.74 67.63,82.55 68.58,83.5 68.58,90.17 67.31,91.44 R10.1 64.13,91.44 60.72,94.85 J1.4 | v53.98,32.38 IC4.21
SOSCI
  Bottom 0.406: X2.1 90.82,73 90.81,73.03
  Bottom 0.61: U$1.17 90.81,73.03 C20.2
SOSCO
  Bottom 0.406: X2.2 90.82,70.5 90.81,70.48
  Bottom 0.61: U$1.16 90.81,70.48 C23.2
TICK
  Bottom 0.61: Q3.1 R7.1
TIMER_CS  (via drill 0.6 pad 1.42)
  Top 0.406: v119.7,40.01 v119.7,30.48
  Bottom 0.406: IC11.15 v119.7,40.01
  Bottom 0.61: IC6.14 v119.7,30.48
TXD  (via drill 0.6 pad 1.42)
  Top 0.406: v133.35,61.59 v133.35,82.55
  Bottom 0.406: U1.10 136.53,62.87 135.25,61.59 v133.35,61.59 | IC2.4 134.62,83.82 v133.35,82.55
UART_CLK  (via drill 0.6 pad 1.42)
  Top 0.406: v146.05,57.47 v146.05,39.05
  Bottom 0.406: U1.6 141.29,52.7 v146.05,57.47 | v146.05,39.05 146.05,35.24 QG1.8
UART_CS  (via drill 0.6 pad 1.42)
  Top 0.406: v127.95,45.09 v127.95,30.16
  Bottom 0.406: IC6.13 125.73,27.94 v127.95,30.16 | U1.3 v127.95,45.09
VCC  (via drill 0.6 pad 1.42)
  Top 0.406: v129.54,42.55 v129.54,32.07 | v110.49,43.81 v110.49,40.01 | v108.59,57.78 v108.59,40.01
  Top 0.61: v70.8,32.6 v70.8,40.01 | v48.9,29.84 v48.9,45.09 | v48.9,66.04 v48.9,52.7 | v48.9,67.94 v48.9,91.44
  Bottom 0.406: R9.2 127.63,24.13 129.54,26.04 v129.54,32.07 | 78.1,29.53 77.47,29.53 CON1.38 | 78.1,29.53 78.1,26.35 | 78.1,26.35 CON1.13 | 78.1,29.53 C7.2 83.82,29.53 85.09,28.26 85.09,26.99 R6.2 | U$1.3 85.72,70.48 | 85.72,70.48 85.72,69.22 87,67.94 U$1.15 | 85.72,70.48 85.72,76.52 85.09,77.15 84.14,77.15 83.5,77.79 83.5,82.55 84.14,83.19 87.31,83.19 87.95,83.82 D2.A | C3.1 99.06,40.01 | R3.2 78.21,26.25 78.1,26.35 | C2.1 122.88,75.57 122.87,75.56 | v129.54,42.55 R14.1
  Bottom 0.61: R5.2 R4.2 | R4.2 75.03,31.01 76.52,29.53 77.47,29.53 | v70.8,32.6 R4.2 | C8.1 63.82,44.77 64.13,45.09 | IC2.8 C4.1 | C11.+ | C12.1 R12.1 | R13.2 77.15,40.32 76.84,40.01 | IC3.3 C16.1 | v48.9,67.94 R15.2 | R16.2 v110.49,43.81 | R34.2 v108.59,57.78 R19.2
  Bottom 0.813: R1.2 QG1.14 C1.1 | R8.2 | R8.2 R10.2 R11.2 IC1.14 C9.1 | J1.3 R8.2 | 122.88,90.11 122.94,90.17 | C30.1 IC5.6
  Bottom 1.016: QG1.14 v129.54,32.07 126.05,32.07 122.56,35.56 IC6.16 116.52,35.56 112.08,40.01 v110.49,40.01 v108.59,40.01 IC11.14 99.06,40.01 76.84,40.01 v70.8,40.01 70.8,43.5 69.22,45.09 64.13,45.09 IC4.26 v48.9,45.09 v48.9,52.7 | U1.15 122.87,75.56 | C2.1 122.88,90.11 | v48.9,66.04 v48.9,67.94
  Bottom 1.27: 94.62,90.17 91.44,87 D2.A | v48.9,91.44 C11.+ IC3.3 70.48,107.52 J1.3 88.38,104.97 94.62,98.74 94.62,90.17 | 127,90.17 IC2.8 | JP3.2 C10.+ 142.88,93.98 139.06,90.17 127,90.17 | SP1.1 | SP1.1 94.62,90.17 | 127,90.17 122.94,90.17 | SP1.1 C5.+ | IC5.6 v48.9,91.44 | v48.9,29.84 35.24,29.84 | 35.24,29.84 31.43,33.66 R12.1 | v48.9,91.44 C14.+ | 35.24,29.84 C15.+ | SP1.1 122.81,90.17 122.88,90.11
  Bottom 1.422: C11.+ R25.1
VPA
  Bottom 0.813: C13.2 U$1.18
  Bottom 1.016: D2.C U$1.18 | D2.C D1.C | D2.C C18.+
WR  (via drill 0.6 pad 1.42)
  Top 0.406: v93.66,43.81 v93.66,55.24 | v81.28,43.81 v81.28,27.94 | v55.24,47.62 v55.24,70.48
  Bottom 0.406: SV1.34 151.77,48.9 144.15,48.9 141.61,46.35 113.66,46.35 112.71,45.4 109.85,45.4 108.27,43.81 v93.66,43.81 v81.28,43.81 72.71,43.81 70.17,46.35 56.52,46.35 v55.24,47.62 | U$1.10 v93.66,55.24 | CON1.35 v81.28,27.94
  Bottom 0.61: v55.24,70.48 IC4.36